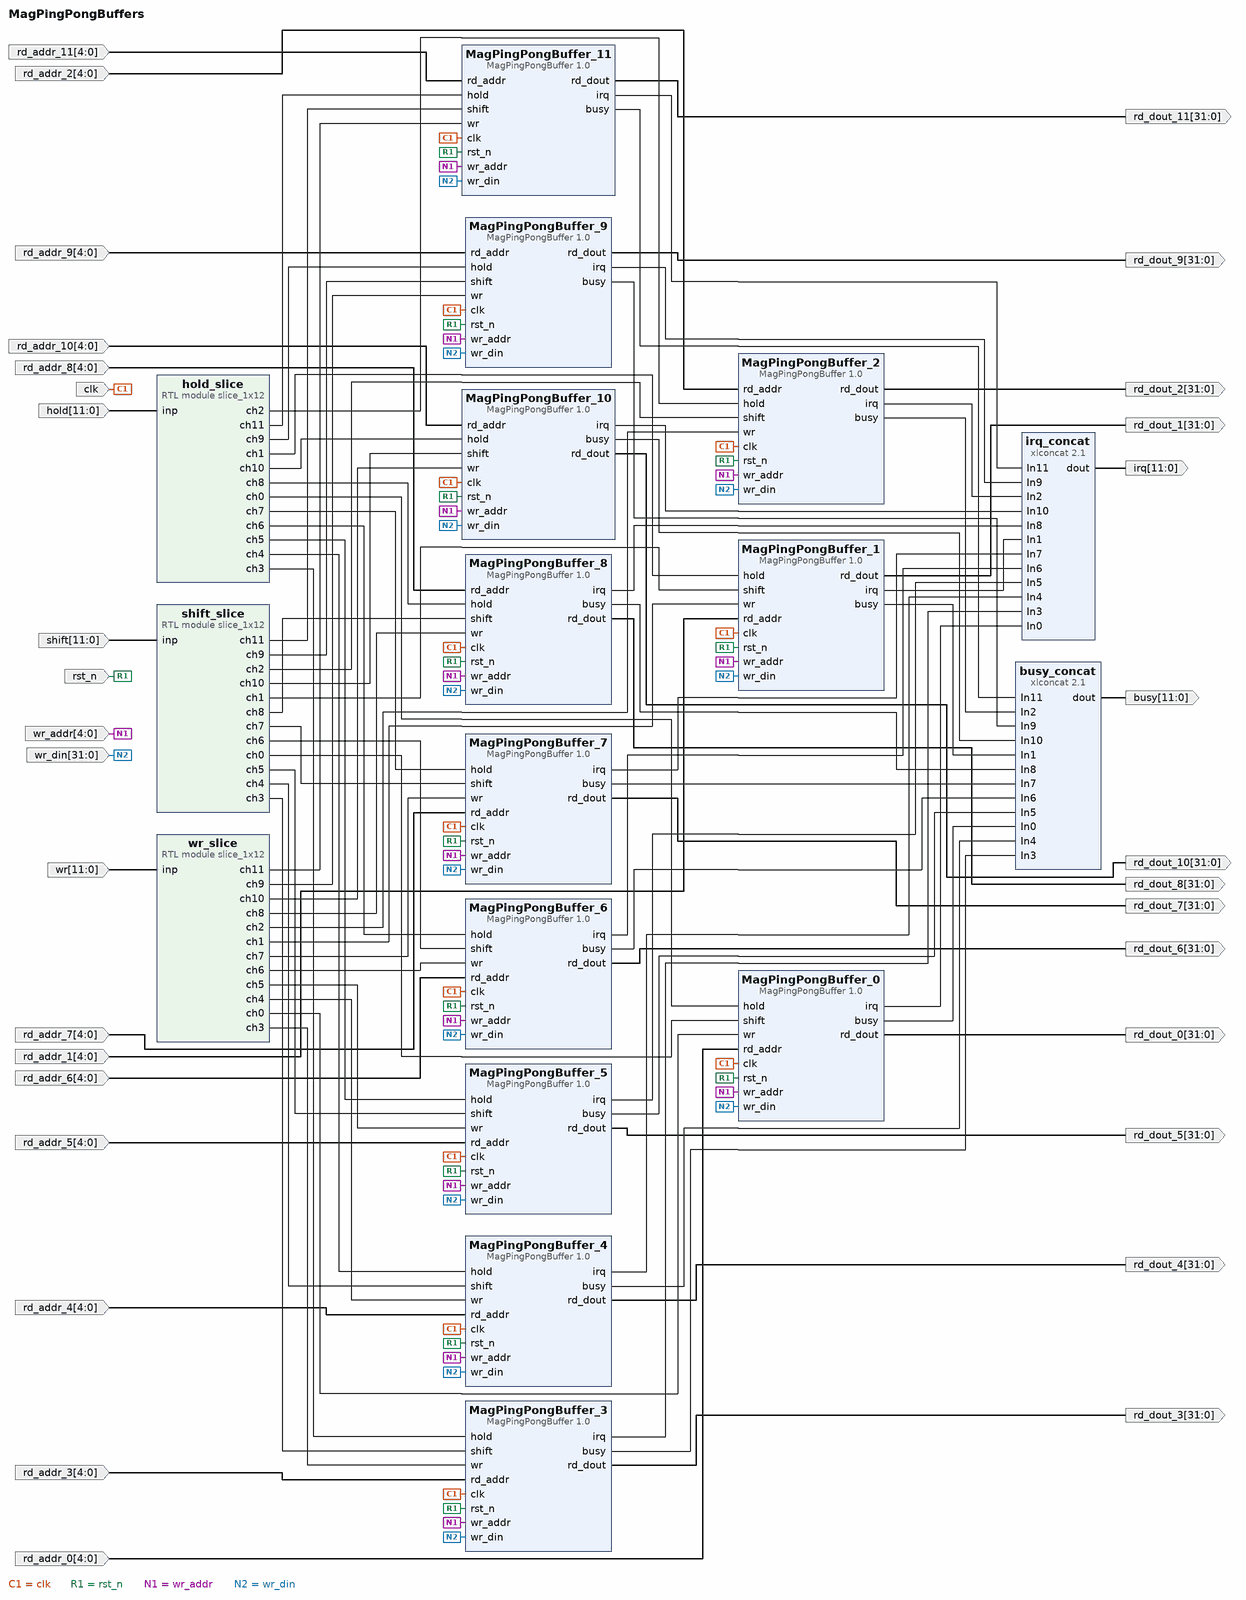
[diagram p0: block diagram of the top level]
# Vivado block design MagPingPongBuffers, xczu3eg-sbva484-1-i, Vivado 2020.2
create_bd_design MagPingPongBuffers

create_bd_port -dir I -from 11 -to 0 wr
create_bd_port -dir I -from 11 -to 0 hold
create_bd_port -dir I -from 11 -to 0 shift
create_bd_port -dir O -from 11 -to 0 irq
create_bd_port -dir O -from 11 -to 0 busy
create_bd_port -dir I -type clk clk
create_bd_port -dir I -type rst rst_n
create_bd_port -dir I -from 31 -to 0 wr_din
create_bd_port -dir I -from 4 -to 0 wr_addr
create_bd_port -dir O -from 31 -to 0 rd_dout_9
create_bd_port -dir O -from 31 -to 0 rd_dout_1
create_bd_port -dir O -from 31 -to 0 rd_dout_0
create_bd_port -dir O -from 31 -to 0 rd_dout_2
create_bd_port -dir O -from 31 -to 0 rd_dout_3
create_bd_port -dir O -from 31 -to 0 rd_dout_4
create_bd_port -dir O -from 31 -to 0 rd_dout_5
create_bd_port -dir O -from 31 -to 0 rd_dout_6
create_bd_port -dir O -from 31 -to 0 rd_dout_7
create_bd_port -dir O -from 31 -to 0 rd_dout_8
create_bd_port -dir O -from 31 -to 0 rd_dout_10
create_bd_port -dir O -from 31 -to 0 rd_dout_11
create_bd_port -dir I -from 4 -to 0 rd_addr_0
create_bd_port -dir I -from 4 -to 0 rd_addr_1
create_bd_port -dir I -from 4 -to 0 rd_addr_2
create_bd_port -dir I -from 4 -to 0 rd_addr_3
create_bd_port -dir I -from 4 -to 0 rd_addr_4
create_bd_port -dir I -from 4 -to 0 rd_addr_5
create_bd_port -dir I -from 4 -to 0 rd_addr_6
create_bd_port -dir I -from 4 -to 0 rd_addr_7
create_bd_port -dir I -from 4 -to 0 rd_addr_8
create_bd_port -dir I -from 4 -to 0 rd_addr_9
create_bd_port -dir I -from 4 -to 0 rd_addr_10
create_bd_port -dir I -from 4 -to 0 rd_addr_11

create_bd_cell -type module -reference slice_1x12 hold_slice
create_bd_cell -type module -reference slice_1x12 wr_slice
create_bd_cell -type module -reference slice_1x12 shift_slice
create_bd_cell -type ip -vlnv xilinx.com:ip:xlconcat:2.1 busy_concat
set_property -dict {CONFIG.NUM_PORTS 12} [get_bd_cells busy_concat]
create_bd_cell -type ip -vlnv xilinx.com:ip:xlconcat:2.1 irq_concat
set_property -dict {CONFIG.NUM_PORTS 12} [get_bd_cells irq_concat]
create_bd_cell -type ip -vlnv DIII:PL-Mag-Sensor:MagPingPongBuffer:1.0 MagPingPongBuffer_0
create_bd_cell -type ip -vlnv DIII:PL-Mag-Sensor:MagPingPongBuffer:1.0 MagPingPongBuffer_1
create_bd_cell -type ip -vlnv DIII:PL-Mag-Sensor:MagPingPongBuffer:1.0 MagPingPongBuffer_10
create_bd_cell -type ip -vlnv DIII:PL-Mag-Sensor:MagPingPongBuffer:1.0 MagPingPongBuffer_11
create_bd_cell -type ip -vlnv DIII:PL-Mag-Sensor:MagPingPongBuffer:1.0 MagPingPongBuffer_2
create_bd_cell -type ip -vlnv DIII:PL-Mag-Sensor:MagPingPongBuffer:1.0 MagPingPongBuffer_3
create_bd_cell -type ip -vlnv DIII:PL-Mag-Sensor:MagPingPongBuffer:1.0 MagPingPongBuffer_4
create_bd_cell -type ip -vlnv DIII:PL-Mag-Sensor:MagPingPongBuffer:1.0 MagPingPongBuffer_5
create_bd_cell -type ip -vlnv DIII:PL-Mag-Sensor:MagPingPongBuffer:1.0 MagPingPongBuffer_6
create_bd_cell -type ip -vlnv DIII:PL-Mag-Sensor:MagPingPongBuffer:1.0 MagPingPongBuffer_7
create_bd_cell -type ip -vlnv DIII:PL-Mag-Sensor:MagPingPongBuffer:1.0 MagPingPongBuffer_8
create_bd_cell -type ip -vlnv DIII:PL-Mag-Sensor:MagPingPongBuffer:1.0 MagPingPongBuffer_9

# ---- connections ----

connect_bd_net -net inp_0_1 [get_bd_ports wr] [get_bd_pins wr_slice/inp]
connect_bd_net -net inp_0_2 [get_bd_ports hold] [get_bd_pins hold_slice/inp]
connect_bd_net -net inp_1_1 [get_bd_ports shift] [get_bd_pins shift_slice/inp]
connect_bd_net [get_bd_pins irq_concat/dout] [get_bd_ports irq]
connect_bd_net [get_bd_pins busy_concat/dout] [get_bd_ports busy]
connect_bd_net [get_bd_ports clk] \
  [get_bd_pins MagPingPongBuffer_0/clk] [get_bd_pins MagPingPongBuffer_1/clk] [get_bd_pins MagPingPongBuffer_10/clk] \
  [get_bd_pins MagPingPongBuffer_11/clk] [get_bd_pins MagPingPongBuffer_2/clk] [get_bd_pins MagPingPongBuffer_3/clk] \
  [get_bd_pins MagPingPongBuffer_4/clk] [get_bd_pins MagPingPongBuffer_5/clk] [get_bd_pins MagPingPongBuffer_6/clk] \
  [get_bd_pins MagPingPongBuffer_7/clk] [get_bd_pins MagPingPongBuffer_8/clk] [get_bd_pins MagPingPongBuffer_9/clk]
connect_bd_net [get_bd_ports rst_n] \
  [get_bd_pins MagPingPongBuffer_0/rst_n] [get_bd_pins MagPingPongBuffer_1/rst_n] [get_bd_pins MagPingPongBuffer_10/rst_n] \
  [get_bd_pins MagPingPongBuffer_11/rst_n] [get_bd_pins MagPingPongBuffer_2/rst_n] [get_bd_pins MagPingPongBuffer_3/rst_n] \
  [get_bd_pins MagPingPongBuffer_4/rst_n] [get_bd_pins MagPingPongBuffer_5/rst_n] [get_bd_pins MagPingPongBuffer_6/rst_n] \
  [get_bd_pins MagPingPongBuffer_7/rst_n] [get_bd_pins MagPingPongBuffer_8/rst_n] [get_bd_pins MagPingPongBuffer_9/rst_n]
connect_bd_net [get_bd_ports wr_addr] \
  [get_bd_pins MagPingPongBuffer_0/wr_addr] [get_bd_pins MagPingPongBuffer_1/wr_addr] \
  [get_bd_pins MagPingPongBuffer_10/wr_addr] [get_bd_pins MagPingPongBuffer_11/wr_addr] \
  [get_bd_pins MagPingPongBuffer_2/wr_addr] [get_bd_pins MagPingPongBuffer_3/wr_addr] \
  [get_bd_pins MagPingPongBuffer_4/wr_addr] [get_bd_pins MagPingPongBuffer_5/wr_addr] \
  [get_bd_pins MagPingPongBuffer_6/wr_addr] [get_bd_pins MagPingPongBuffer_7/wr_addr] \
  [get_bd_pins MagPingPongBuffer_8/wr_addr] [get_bd_pins MagPingPongBuffer_9/wr_addr]
connect_bd_net [get_bd_ports wr_din] \
  [get_bd_pins MagPingPongBuffer_0/wr_din] [get_bd_pins MagPingPongBuffer_1/wr_din] [get_bd_pins MagPingPongBuffer_10/wr_din] \
  [get_bd_pins MagPingPongBuffer_11/wr_din] [get_bd_pins MagPingPongBuffer_2/wr_din] [get_bd_pins MagPingPongBuffer_3/wr_din] \
  [get_bd_pins MagPingPongBuffer_4/wr_din] [get_bd_pins MagPingPongBuffer_5/wr_din] [get_bd_pins MagPingPongBuffer_6/wr_din] \
  [get_bd_pins MagPingPongBuffer_7/wr_din] [get_bd_pins MagPingPongBuffer_8/wr_din] [get_bd_pins MagPingPongBuffer_9/wr_din]
connect_bd_net [get_bd_pins hold_slice/ch1] [get_bd_pins MagPingPongBuffer_1/hold]
connect_bd_net [get_bd_pins hold_slice/ch3] [get_bd_pins MagPingPongBuffer_3/hold]
connect_bd_net [get_bd_pins hold_slice/ch2] [get_bd_pins MagPingPongBuffer_2/hold]
connect_bd_net [get_bd_pins hold_slice/ch4] [get_bd_pins MagPingPongBuffer_4/hold]
connect_bd_net [get_bd_pins hold_slice/ch5] [get_bd_pins MagPingPongBuffer_5/hold]
connect_bd_net [get_bd_pins hold_slice/ch7] [get_bd_pins MagPingPongBuffer_7/hold]
connect_bd_net [get_bd_pins hold_slice/ch6] [get_bd_pins MagPingPongBuffer_6/hold]
connect_bd_net [get_bd_pins hold_slice/ch8] [get_bd_pins MagPingPongBuffer_8/hold]
connect_bd_net [get_bd_pins hold_slice/ch9] [get_bd_pins MagPingPongBuffer_9/hold]
connect_bd_net [get_bd_pins hold_slice/ch11] [get_bd_pins MagPingPongBuffer_11/hold]
connect_bd_net [get_bd_pins hold_slice/ch0] [get_bd_pins MagPingPongBuffer_0/hold]
connect_bd_net [get_bd_pins hold_slice/ch10] [get_bd_pins MagPingPongBuffer_10/hold]
connect_bd_net [get_bd_pins shift_slice/ch1] [get_bd_pins MagPingPongBuffer_1/shift]
connect_bd_net [get_bd_pins shift_slice/ch3] [get_bd_pins MagPingPongBuffer_3/shift]
connect_bd_net [get_bd_pins shift_slice/ch2] [get_bd_pins MagPingPongBuffer_2/shift]
connect_bd_net [get_bd_pins shift_slice/ch4] [get_bd_pins MagPingPongBuffer_4/shift]
connect_bd_net [get_bd_pins shift_slice/ch5] [get_bd_pins MagPingPongBuffer_5/shift]
connect_bd_net [get_bd_pins shift_slice/ch7] [get_bd_pins MagPingPongBuffer_7/shift]
connect_bd_net [get_bd_pins shift_slice/ch6] [get_bd_pins MagPingPongBuffer_6/shift]
connect_bd_net [get_bd_pins shift_slice/ch8] [get_bd_pins MagPingPongBuffer_8/shift]
connect_bd_net [get_bd_pins shift_slice/ch9] [get_bd_pins MagPingPongBuffer_9/shift]
connect_bd_net [get_bd_pins shift_slice/ch11] [get_bd_pins MagPingPongBuffer_11/shift]
connect_bd_net [get_bd_pins shift_slice/ch0] [get_bd_pins MagPingPongBuffer_0/shift]
connect_bd_net [get_bd_pins shift_slice/ch10] [get_bd_pins MagPingPongBuffer_10/shift]
connect_bd_net [get_bd_pins wr_slice/ch1] [get_bd_pins MagPingPongBuffer_1/wr]
connect_bd_net [get_bd_pins wr_slice/ch3] [get_bd_pins MagPingPongBuffer_3/wr]
connect_bd_net [get_bd_pins wr_slice/ch2] [get_bd_pins MagPingPongBuffer_2/wr]
connect_bd_net [get_bd_pins wr_slice/ch4] [get_bd_pins MagPingPongBuffer_4/wr]
connect_bd_net [get_bd_pins wr_slice/ch5] [get_bd_pins MagPingPongBuffer_5/wr]
connect_bd_net [get_bd_pins wr_slice/ch7] [get_bd_pins MagPingPongBuffer_7/wr]
connect_bd_net [get_bd_pins wr_slice/ch6] [get_bd_pins MagPingPongBuffer_6/wr]
connect_bd_net [get_bd_pins wr_slice/ch8] [get_bd_pins MagPingPongBuffer_8/wr]
connect_bd_net [get_bd_pins wr_slice/ch9] [get_bd_pins MagPingPongBuffer_9/wr]
connect_bd_net [get_bd_pins wr_slice/ch11] [get_bd_pins MagPingPongBuffer_11/wr]
connect_bd_net [get_bd_pins wr_slice/ch0] [get_bd_pins MagPingPongBuffer_0/wr]
connect_bd_net [get_bd_pins wr_slice/ch10] [get_bd_pins MagPingPongBuffer_10/wr]
connect_bd_net [get_bd_pins MagPingPongBuffer_3/busy] [get_bd_pins busy_concat/In3]
connect_bd_net [get_bd_pins MagPingPongBuffer_1/busy] [get_bd_pins busy_concat/In1]
connect_bd_net [get_bd_pins MagPingPongBuffer_4/busy] [get_bd_pins busy_concat/In4]
connect_bd_net [get_bd_pins MagPingPongBuffer_2/busy] [get_bd_pins busy_concat/In2]
connect_bd_net [get_bd_pins MagPingPongBuffer_7/busy] [get_bd_pins busy_concat/In7]
connect_bd_net [get_bd_pins MagPingPongBuffer_5/busy] [get_bd_pins busy_concat/In5]
connect_bd_net [get_bd_pins MagPingPongBuffer_8/busy] [get_bd_pins busy_concat/In8]
connect_bd_net [get_bd_pins MagPingPongBuffer_6/busy] [get_bd_pins busy_concat/In6]
connect_bd_net [get_bd_pins MagPingPongBuffer_11/busy] [get_bd_pins busy_concat/In11]
connect_bd_net [get_bd_pins MagPingPongBuffer_9/busy] [get_bd_pins busy_concat/In9]
connect_bd_net [get_bd_pins MagPingPongBuffer_0/busy] [get_bd_pins busy_concat/In0]
connect_bd_net [get_bd_pins MagPingPongBuffer_10/busy] [get_bd_pins busy_concat/In10]
connect_bd_net [get_bd_pins MagPingPongBuffer_1/irq] [get_bd_pins irq_concat/In1]
connect_bd_net [get_bd_pins MagPingPongBuffer_3/irq] [get_bd_pins irq_concat/In3]
connect_bd_net [get_bd_pins MagPingPongBuffer_4/irq] [get_bd_pins irq_concat/In4]
connect_bd_net [get_bd_pins MagPingPongBuffer_2/irq] [get_bd_pins irq_concat/In2]
connect_bd_net [get_bd_pins MagPingPongBuffer_7/irq] [get_bd_pins irq_concat/In7]
connect_bd_net [get_bd_pins MagPingPongBuffer_5/irq] [get_bd_pins irq_concat/In5]
connect_bd_net [get_bd_pins MagPingPongBuffer_8/irq] [get_bd_pins irq_concat/In8]
connect_bd_net [get_bd_pins MagPingPongBuffer_6/irq] [get_bd_pins irq_concat/In6]
connect_bd_net [get_bd_pins MagPingPongBuffer_11/irq] [get_bd_pins irq_concat/In11]
connect_bd_net [get_bd_pins MagPingPongBuffer_9/irq] [get_bd_pins irq_concat/In9]
connect_bd_net [get_bd_pins MagPingPongBuffer_10/irq] [get_bd_pins irq_concat/In10]
connect_bd_net [get_bd_pins MagPingPongBuffer_0/irq] [get_bd_pins irq_concat/In0]
connect_bd_net [get_bd_pins MagPingPongBuffer_9/rd_dout] [get_bd_ports rd_dout_9]
connect_bd_net [get_bd_pins MagPingPongBuffer_1/rd_dout] [get_bd_ports rd_dout_1]
connect_bd_net [get_bd_pins MagPingPongBuffer_0/rd_dout] [get_bd_ports rd_dout_0]
connect_bd_net [get_bd_pins MagPingPongBuffer_2/rd_dout] [get_bd_ports rd_dout_2]
connect_bd_net [get_bd_pins MagPingPongBuffer_3/rd_dout] [get_bd_ports rd_dout_3]
connect_bd_net [get_bd_pins MagPingPongBuffer_4/rd_dout] [get_bd_ports rd_dout_4]
connect_bd_net [get_bd_pins MagPingPongBuffer_5/rd_dout] [get_bd_ports rd_dout_5]
connect_bd_net [get_bd_pins MagPingPongBuffer_6/rd_dout] [get_bd_ports rd_dout_6]
connect_bd_net [get_bd_pins MagPingPongBuffer_7/rd_dout] [get_bd_ports rd_dout_7]
connect_bd_net [get_bd_pins MagPingPongBuffer_8/rd_dout] [get_bd_ports rd_dout_8]
connect_bd_net [get_bd_pins MagPingPongBuffer_10/rd_dout] [get_bd_ports rd_dout_10]
connect_bd_net [get_bd_pins MagPingPongBuffer_11/rd_dout] [get_bd_ports rd_dout_11]
connect_bd_net -net rd_addr_0_1 [get_bd_ports rd_addr_0] [get_bd_pins MagPingPongBuffer_0/rd_addr]
connect_bd_net -net rd_addr_1_1 [get_bd_ports rd_addr_1] [get_bd_pins MagPingPongBuffer_1/rd_addr]
connect_bd_net -net rd_addr_2_1 [get_bd_ports rd_addr_2] [get_bd_pins MagPingPongBuffer_2/rd_addr]
connect_bd_net -net rd_addr_3_1 [get_bd_ports rd_addr_3] [get_bd_pins MagPingPongBuffer_3/rd_addr]
connect_bd_net -net rd_addr_4_1 [get_bd_ports rd_addr_4] [get_bd_pins MagPingPongBuffer_4/rd_addr]
connect_bd_net -net rd_addr_5_1 [get_bd_ports rd_addr_5] [get_bd_pins MagPingPongBuffer_5/rd_addr]
connect_bd_net -net rd_addr_6_1 [get_bd_ports rd_addr_6] [get_bd_pins MagPingPongBuffer_6/rd_addr]
connect_bd_net -net rd_addr_7_1 [get_bd_ports rd_addr_7] [get_bd_pins MagPingPongBuffer_7/rd_addr]
connect_bd_net -net rd_addr_8_1 [get_bd_ports rd_addr_8] [get_bd_pins MagPingPongBuffer_8/rd_addr]
connect_bd_net -net rd_addr_9_1 [get_bd_ports rd_addr_9] [get_bd_pins MagPingPongBuffer_9/rd_addr]
connect_bd_net -net rd_addr_10_1 [get_bd_ports rd_addr_10] [get_bd_pins MagPingPongBuffer_10/rd_addr]
connect_bd_net -net rd_addr_11_1 [get_bd_ports rd_addr_11] [get_bd_pins MagPingPongBuffer_11/rd_addr]

validate_bd_design
save_bd_design
